# Altium project ISL6236A_DEMO_V1I1.PrjPcb
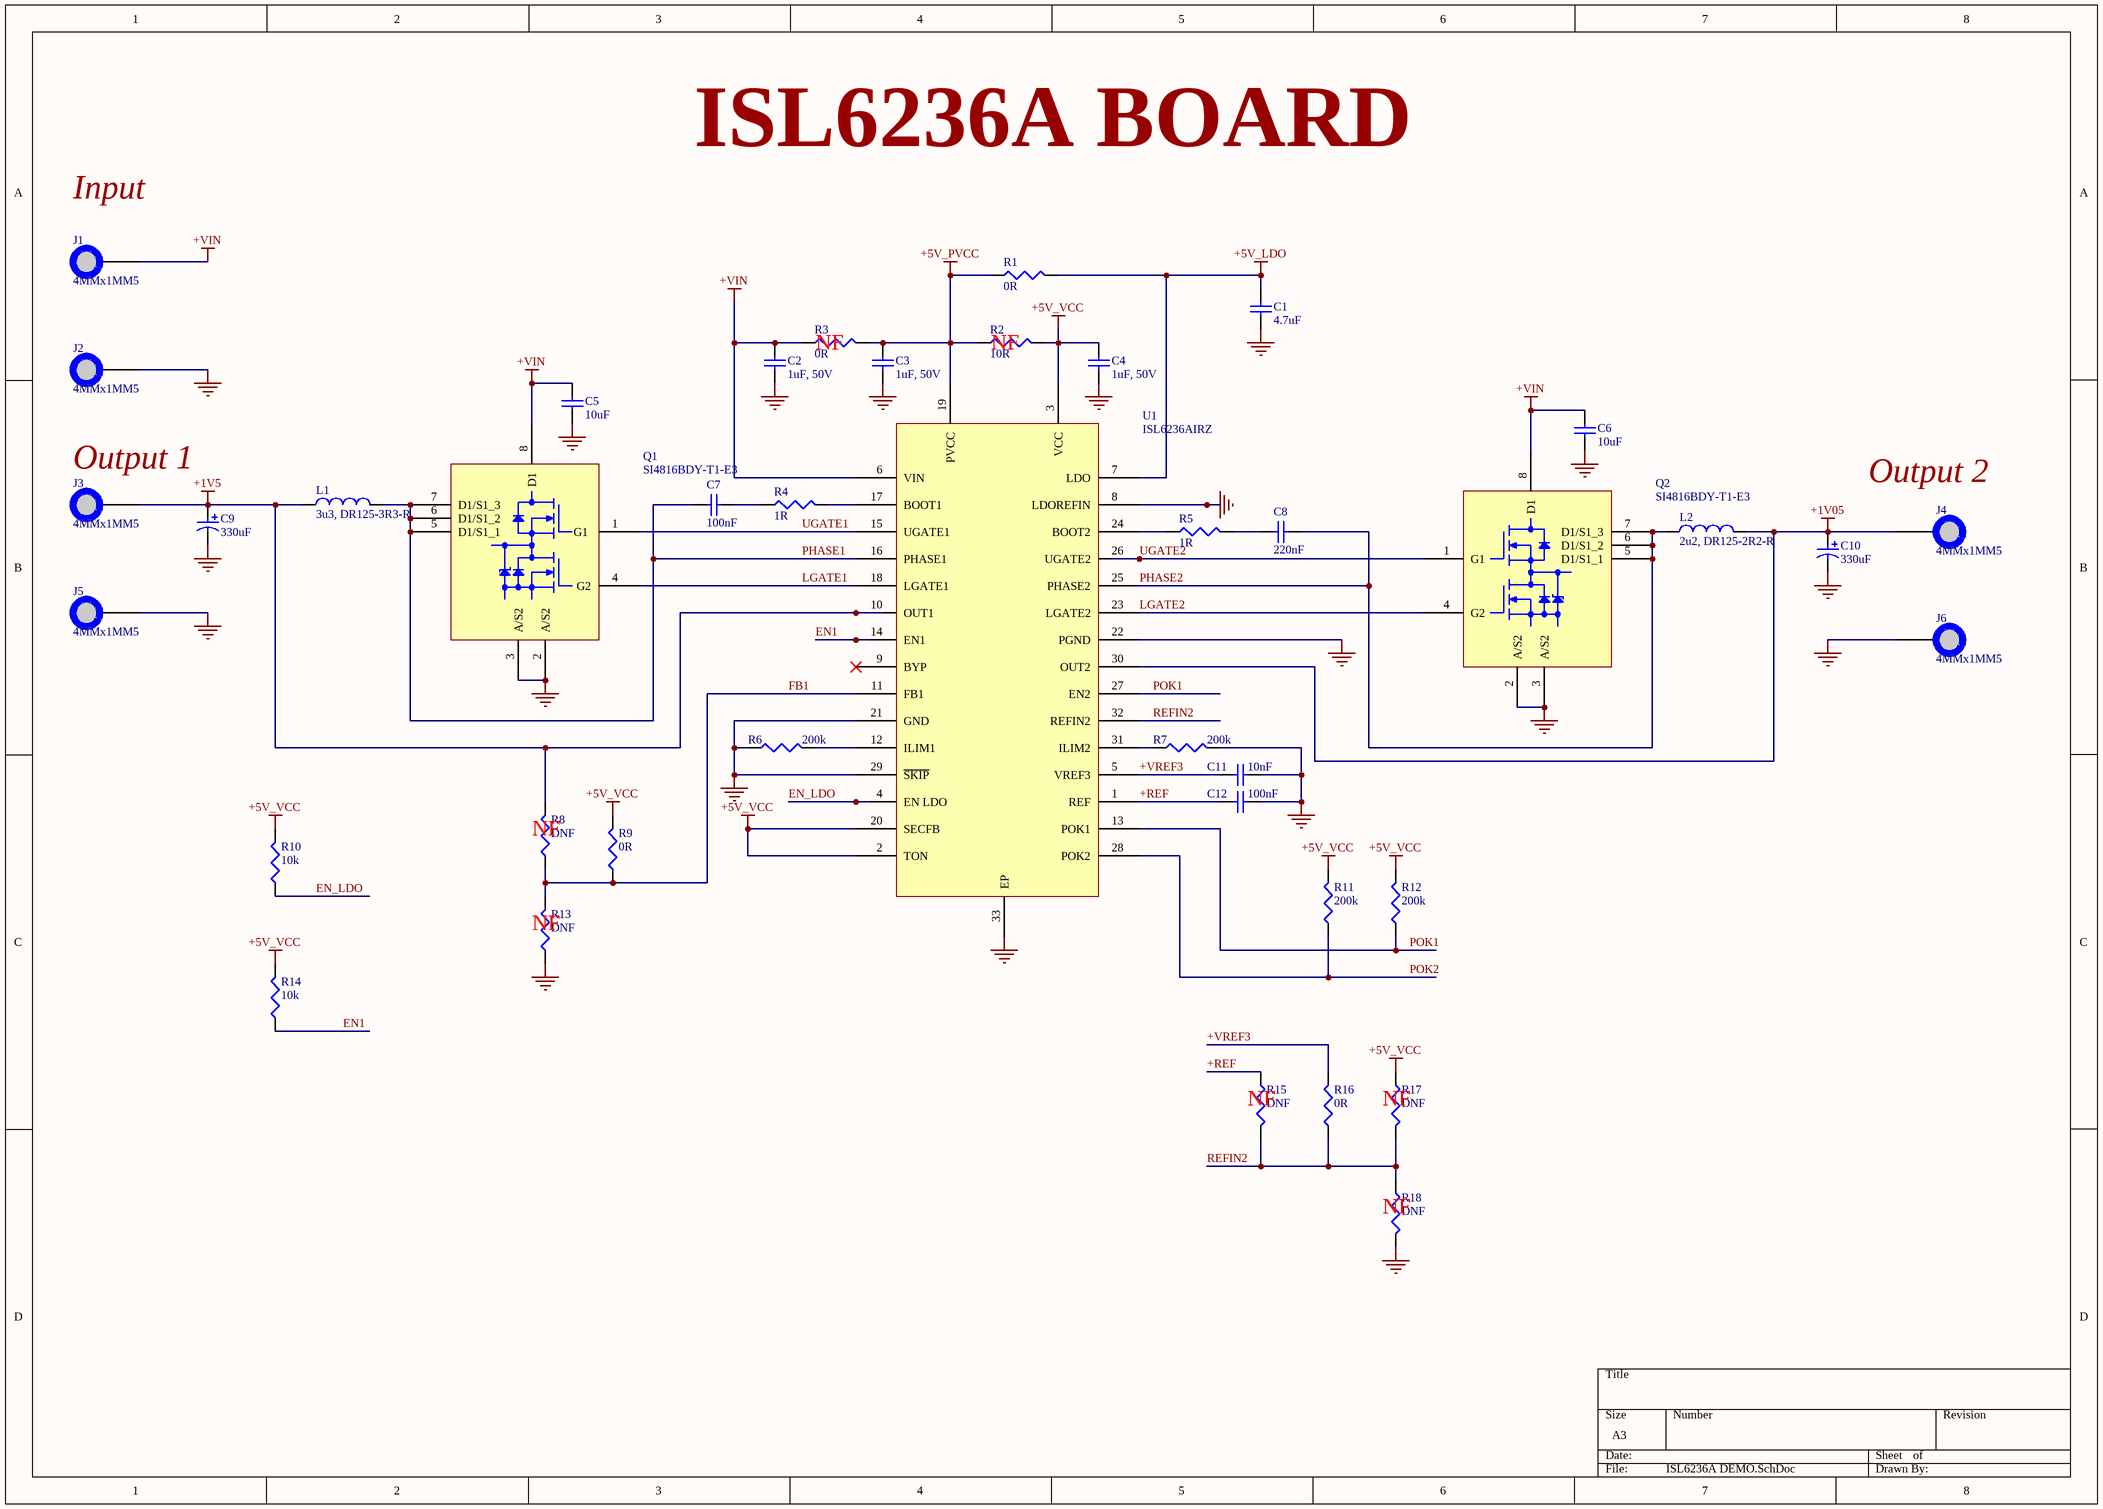
[diagram p0: ISL6236A DEMO.SchDoc]
1 sheet, 41 parts. Net scope: global (net labels, ports and power ports of the same name join across sheets).
Board file: ISL6236A DEMO_PCB_V1I1.PcbDoc

## Sheet ISL6236A DEMO.SchDoc
size A3

### Parts
C1  4.7uF  [C1206]
C2  1uF, 50V  [C0805]
C3  1uF, 50V  [C0805]
C4  1uF, 50V  [C0805]
C5  10uF  [C1210]
C6  10uF  [C1210]
C7  100nF  [C0805]
C8  220nF  [C0805]
C9  330uF  [7343-43]
C10  330uF  [7343-43]
C11  10nF  [C0805]
C12  100nF  [C0805]
J1  4MMx1MM5  [PAD_WITH_HOLE_4MMx1MM5]
J2  4MMx1MM5  [PAD_WITH_HOLE_4MMx1MM5]
J3  4MMx1MM5  [PAD_WITH_HOLE_4MMx1MM5]
J4  4MMx1MM5  [PAD_WITH_HOLE_4MMx1MM5]
J5  4MMx1MM5  [PAD_WITH_HOLE_4MMx1MM5]
J6  4MMx1MM5  [PAD_WITH_HOLE_4MMx1MM5]
L1  3u3, DR125-3R3-R  [DR125]
L2  2u2, DR125-2R2-R  [DR125]
Q1  SI4816BDY-T1-E3  [SO-8]
Q2  SI4816BDY-T1-E3  [SO-8]
R1  0R  [R0805]
R2  10R  [R0805]
R3  0R  [R0805]
R4  1R  [R0805]
R5  1R  [R0805]
R6  200k  [R0805]
R7  200k  [R0805]
R8  DNF  [R0805]
R9  0R  [R0805]
R10  10k  [R0805]
R11  200k  [R0805]
R12  200k  [R0805]
R13  DNF  [R0805]
R14  10k  [R0805]
R15  DNF  [R0805]
R16  0R  [R0805]
R17  DNF  [R0805]
R18  DNF  [R0805]
U1  ISL6236AIRZ  [L32.5x5B]

### Nets
+1V05: C10.1 J4.1 L2.2 U1.30(OUT2)
+1V5: C9.1 J3.1 L1.1 R8.2 U1.10(OUT1)
+5V_LDO: C1.1 R1.2 U1.7(LDO)
+5V_PVCC: C3.2 R1.1 R2.1 R3.2 U1.19(PVCC)
+5V_VCC: C4.2 R2.2 R9.2 R10.2 R11.2 R12.2 R14.2 R17.1 U1.2(TON) U1.3(VCC) U1.20(SECFB)
+VIN: C2.2 C5.2 C6.1 J1.1 Q1.8(D1) Q2.8(D1) R3.1 U1.6(VIN)
GND: C1.2 C2.1 C3.1 C4.1 C5.1 C6.2 C9.2 C10.2 C11.2 C12.2 J2.1 J5.1 J6.1 Q1.2(A/S2) Q1.3(A/S2) Q2.2(A/S2) Q2.3(A/S2) R6.1 R7.2 R13.1 R18.2 U1.8(LDOREFIN) U1.21(GND) U1.22(PGND) U1.29(~{SKIP}) U1.33(EP)
+REF: C12.1 R15.1 U1.1(REF)
+VREF3: C11.1 R16.2 U1.5(VREF3)
EN1: R14.1 U1.14(EN1)
EN_LDO: R10.1 U1.4(EN_LDO)
FB1: R8.1 R9.1 R13.2 U1.11(FB1)
LGATE1: Q1.4(G2) U1.18(LGATE1)
LGATE2: Q2.4(G2) U1.23(LGATE2)
PHASE1: C7.1 L1.2 Q1.5(D1/S1_1) Q1.6(D1/S1_2) Q1.7(D1/S1_3) U1.16(PHASE1)
PHASE2: C8.2 L2.1 Q2.5(D1/S1_1) Q2.6(D1/S1_2) Q2.7(D1/S1_3) U1.25(PHASE2)
POK1: R12.1 U1.13(POK1) U1.27(EN2)
POK2: R11.1 U1.28(POK2)
REFIN2: R15.2 R16.1 R17.2 R18.1 U1.32(REFIN2)
UGATE1: Q1.1(G1) U1.15(UGATE1)
UGATE2: Q2.1(G1) U1.26(UGATE2)
NetC7_2: C7.2 R4.1
NetC8_1: C8.1 R5.2
NetR4_2: R4.2 U1.17(BOOT1)
NetR5_1: R5.1 U1.24(BOOT2)
NetR6_2: R6.2 U1.12(ILIM1)
NetR7_1: R7.1 U1.31(ILIM2)

Not connected (* = marked no-connect by the designer): U1 9(BYP)*

### Notes on the sheet
- ISL6236A BOARD
- Input
- (near R3) NF
- (near R2) NF
- Output 1
- (near J4) Output 2
- (near R8) NF
- (near R13) NF
- (near R15) NF
- (near R17) NF
- (near R18) NF

### Library data of the parts
C1 = C3216X5R1H475K160AB: CAP CER 4.7UF 50V X5R 1206; Manufacturer 1: TDK; Dielectric Material: Ceramic; Tolerance: 10%; Supplier 1: Digi-Key; Manufacturer Part Number 1: C3216X5R1H475K160AB; Stock 1: 12830; Pricing 1: 1=0.90000, 10=0.66400, 100=0.45540, 500=0.36052, 1000=0.30360 (USD); RoHS: Yes; Mount: Surface Mount; Case/Package: 1206; Weight: 0.000571oz; Case Code (Imperial): 1206; Case Code (Metric): 3216; Min Operating Temperature: -55°C; Max Operating Temperature: 85°C; Capacitance: 4.7uF; Packaging: Tape and Reel; Voltage Rating: 50V; Voltage Rating (DC): 50V; Package Quantity: 1; Dielectric: X5R; Termination: SMD/SMT; Composition: Ceramic; Length: 3.2mm; Height: 1.6mm; Width: 1.6mm; Thickness: 0.071inch; Depth: 1.6mm; Lead Free: Lead Free; ComponentLink1URL: https://datasheet.ciiva.com/24216/c3216x5r1h475k160ab-265269-24216325.pdf?src-supplier=Mouser; ComponentLink1Description: https://datasheet.ciiva.com/24216/c3216x5r1h475k160ab-265269-24216325.pdf?src-supplier=Mouser; ComponentLink2URL: https://datasheet.ciiva.com/6286/tdkmlcccaprange-6286230.pdf?src-supplier=Digi-Key; ComponentLink2Description: https://datasheet.ciiva.com/6286/tdkmlcccaprange-6286230.pdf?src-supplier=Digi-Key; ComponentLink3URL: https://datasheet.ciiva.com/6286/tdkmlcccaprange-6286233.pdf?src-supplier=Digi-Key; ComponentLink3Description: https://datasheet.ciiva.com/6286/tdkmlcccaprange-6286233.pdf?src-supplier=Digi-Key; ComponentLink4URL: https://datasheet.ciiva.com/6286/tdkmlcccaprange-6286236.pdf?src-supplier=Digi-Key; ComponentLink4Description: https://datasheet.ciiva.com/6286/tdkmlcccaprange-6286236.pdf?src-supplier=Digi-Key; Supplier Part Number 1: 445-5994-1-ND
C2-C4 = C0805C105K5RACTU: Cap Ceramic 1uF 50V X7R 10% Pad SMD 0805 125°C T/R; Manufacturer 1: KEMET; Supplier 1: Digi-Key; Manufacturer Part Number 1: C0805C105K5RACTU; Stock 1: 0; Pricing 1: 1=0.40000, 10=0.27700, 100=0.16620, 500=0.12466, 1000=0.10527 (USD); RoHS: Yes; Mount: Surface Mount,PCB; Case/Package: 0805; Case Code (Metric): 2012; Case Code (Imperial): 0805; Contact Plating: Tin,Matte; Dielectric Material: Ceramic; Min Operating Temperature: -55°C; Max Operating Temperature: 125°C; Packaging: Tape and Reel; Capacitance: 1uF; Tolerance: 10%; Voltage Rating: 50V; Voltage Rating (DC): 50V; Package Quantity: 1; Dielectric: X7R; Termination: SMD/SMT; Voltage: 50V; Length: 2mm; Height: 1.25mm; Width: 0.049inch; Thickness: 0.055inch; Depth: 1.25mm; REACH SVHC: No SVHC; ComponentLink1URL: https://datasheet.ciiva.com/7842/1732744-7842192.pdf?src-supplier=Element14; ComponentLink1Description: https://datasheet.ciiva.com/7842/1732744-7842192.pdf?src-supplier=Element14; ComponentLink2URL: https://datasheet.ciiva.com/5408/kem-c1002-x7r-smd-5408569.pdf?src-supplier=Mouser; ComponentLink2Description: https://datasheet.ciiva.com/5408/kem-c1002-x7r-smd-5408569.pdf?src-supplier=Mouser; ComponentLink3URL: https://datasheet.ciiva.com/22700/1851736-22700523.pdf?src-supplier=Element14; ComponentLink3Description: https://datasheet.ciiva.com/22700/1851736-22700523.pdf?src-supplier=Element14; Supplier Part Number 1: 399-7409-1-ND
C5 C6 = C1210C106K6PACTU: KEMET - C1210C106K6PACTU - CAP, MLCC, X5R, 10UF, 35V, 1210; Dielectric Material: Ceramic; Dissipation Factor: 2.5%; Tolerance: 10%; Supplier 1: Digi-Key; Manufacturer 1: KEMET; Manufacturer Part Number 1: C1210C106K6PACTU; Stock 1: 52713; Pricing 1: 1=0.82000, 10=0.60300, 100=0.41380, 500=0.32760, 1000=0.27588 (USD); RoHS: Yes; Mount: Surface Mount; Case/Package: 1210; Case Code (Metric): 3225; Case Code (Imperial): 1210; Min Operating Temperature: -55°C; Max Operating Temperature: 85°C; Packaging: Tape and Reel; Capacitance: 10uF; Voltage Rating: 35V; Voltage: 35V; Dielectric: X5R; Termination: Solder; Voltage Rating (DC): 35V; Length: 0.126inch; Height: 1.9mm; Width: 0.098inch; Thickness: 0.083inch; Depth: 2.5mm; Lead Free: Lead Free; ComponentLink1URL: http://www.alliedelec.com/m/d/f3c02ddb98afa3dd1adcb801109671e9.pdf?src-supplier=Allied+Electronics; ComponentLink1Description: http://www.alliedelec.com/m/d/f3c02ddb98afa3dd1adcb801109671e9.pdf?src-supplier=Allied+Electronics; ComponentLink2URL: http://www.farnell.com/datasheets/2741192.pdf?src-supplier=Farnell; ComponentLink2Description: http://www.farnell.com/datasheets/2741192.pdf?src-supplier=Farnell; ComponentLink3URL: https://api.kemet.com/component-edge/download/datasheet/C1210C106K6PAC7800.pdf?src-supplier=Digi-Key; ComponentLink3Description: https://api.kemet.com/component-edge/download/datasheet/C1210C106K6PAC7800.pdf?src-supplier=Digi-Key; ComponentLink4URL: http://www.kemet.com/docfinder?Partnumber=C1210C106K6PAC7800&src-supplier=Digi-Key; ComponentLink4Description: http://www.kemet.com/docfinder?Partnumber=C1210C106K6PAC7800&src-supplier=Digi-Key; ComponentLink5URL: http://www.farnell.com/datasheets/2741192.pdf?src-supplier=Newark; ComponentLink5Description: http://www.farnell.com/datasheets/2741192.pdf?src-supplier=Newark; Supplier Part Number 1: 399-12070-1-ND
C7 C12 = C0805C104K5RACTU: Cap Ceramic 0.1uF 50V X7R 10% SMD 2.0 x 1.2 mm 125 C Paper T/R; Manufacturer 1: KEMET; Voltage: 500V; Supplier 1: Digi-Key; Manufacturer Part Number 1: C0805C104K5RACTU; Stock 1: 146225; Pricing 1: 1=0.17000, 10=0.12100, 100=0.05670, 500=0.03976, 1000=0.03291 (USD); RoHS: Yes; Mount: Surface Mount,PCB; Case/Package: 0805; Number of Pins: 2; Dielectric Material: Ceramic; Case Code (Imperial): 0805; Case Code (Metric): 2012; Contact Plating: Tin,Matte; Min Operating Temperature: -55°C; Max Operating Temperature: 125°C; Capacitance: 100nF; Tolerance: 10%; Packaging: Tape and Reel; Voltage Rating (DC): 50V; Dielectric: X7R; Termination: SMD/SMT; Package Quantity: 4000; Voltage Rating: 50V; Length: 2mm; Height: 0.9mm; Width: 1.2mm; Lead Pitch: 0.75mm; Depth: 1.25mm; Thickness: 0.035inch; Radiation Hardening: No; REACH SVHC: No SVHC; ComponentLink1URL: https://datasheet.ciiva.com/14589/70095383-14589048.pdf?src-supplier=Allied+Electronics; ComponentLink1Description: https://datasheet.ciiva.com/14589/70095383-14589048.pdf?src-supplier=Allied+Electronics; ComponentLink2URL: https://datasheet.ciiva.com/28682/1851736-28682232.pdf?src-supplier=Element14; ComponentLink2Description: https://datasheet.ciiva.com/28682/1851736-28682232.pdf?src-supplier=Element14; ComponentLink3URL: https://datasheet.ciiva.com/32431/slceramic-chip-condensers-e-32431755.pdf?src-supplier=Distrelec; ComponentLink3Description: https://datasheet.ciiva.com/32431/slceramic-chip-condensers-e-32431755.pdf?src-supplier=Distrelec; ComponentLink4URL: https://datasheet.ciiva.com/18410/70095383-18410815.pdf?src-supplier=Allied+Electronics; ComponentLink4Description: https://datasheet.ciiva.com/18410/70095383-18410815.pdf?src-supplier=Allied+Electronics; Supplier Part Number 1: 399-1170-6-ND
C8 = C0805C224K5RACTU: CAP CER 0.22UF 50V X7R 0805; Manufacturer 1: KEMET; Dielectric Material: Ceramic; Tolerance: 10%; Dissipation Factor: 2.5%; Supplier 1: Digi-Key; Manufacturer Part Number 1: C0805C224K5RACTU; Stock 1: 1706361; Pricing 1: 1=0.20000, 10=0.13900, 100=0.06550, 500=0.04592, 1000=0.03802 (USD); RoHS: Yes; Mount: Surface Mount,PCB; Case/Package: 0805; Case Code (Metric): 2012; Case Code (Imperial): 0805; Min Operating Temperature: -55°C; Max Operating Temperature: 125°C; Package Quantity: 1; Capacitance: 220nF; Voltage Rating: 50V; Packaging: Tape and Reel; Voltage Rating (DC): 50V; Dielectric: X7R; Termination: SMD/SMT; Voltage: 50V; Length: 2mm; Height: 1.1mm; Width: 0.049inch; Thickness: 0.055inch; Lead Pitch: 0.75mm; Depth: 1.25mm; Radiation Hardening: No; REACH SVHC: No SVHC; ComponentLink1URL: https://datasheet.ciiva.com/7842/kem-c1002-x7r-smd-7842582.pdf?src-supplier=Element14; ComponentLink1Description: https://datasheet.ciiva.com/7842/kem-c1002-x7r-smd-7842582.pdf?src-supplier=Element14; ComponentLink2URL: https://datasheet.ciiva.com/18193/getdatasheetpartid-304413-18193686.pdf?src-supplier=Verical; ComponentLink2Description: https://datasheet.ciiva.com/18193/getdatasheetpartid-304413-18193686.pdf?src-supplier=Verical; ComponentLink3URL: https://datasheet.ciiva.com/28682/1851736-28682316.pdf?src-supplier=Element14; ComponentLink3Description: https://datasheet.ciiva.com/28682/1851736-28682316.pdf?src-supplier=Element14; Supplier Part Number 1: 399-3491-1-ND
C9 C10 = T530X337M010ATE004: Tantalum Capacitors - Polymer SMD 330uF 10volts 20%; Manufacturer 1: KEMET; Ripple Current: 8.2A; Voltage Rating (DC): 10V; ESR (Equivalent Series Resistance): 4mR; Leakage Current: 330uA; Polarity: Polar; Dissipation Factor: 8%; Life (Hours): 2000Hour; Manufacturer Part Number 1: T530X337M010ATE004; Stock 1: 3288; Pricing 1: 1=6.86000, 10=6.09500, 100=4.87600 (USD); RoHS: Yes; Mount: Surface Mount,PCB; Case/Package: 2917; Case Code (Imperial): 2917; Case Code (Metric): 7343; Min Operating Temperature: -55°C; Max Operating Temperature: 125°C; Package Quantity: 500; Capacitance: 330uF; Tolerance: 20%; Packaging: Tape and Reel; Voltage Rating: 10V; Termination: SMD/SMT; Voltage: 10V; Features: General Purpose; Length: 7.3mm; Height: 4mm; Width: 4.3mm; Height - Seated (Max): 0.169inch; Depth: 4.3mm; REACH SVHC: No SVHC; ComponentLink1URL: https://datasheet.ciiva.com/11794/0900766b80deaa91-11794477.pdf?src-supplier=RSComponents; ComponentLink1Description: https://datasheet.ciiva.com/11794/0900766b80deaa91-11794477.pdf?src-supplier=RSComponents; ComponentLink2URL: https://datasheet.ciiva.com/14593/70096008-14593753.pdf?src-supplier=Allied+Electronics; ComponentLink2Description: https://datasheet.ciiva.com/14593/70096008-14593753.pdf?src-supplier=Allied+Electronics; Supplier 1: Digi-Key; Supplier Part Number 1: 399-10378-1-ND
C11 = C0805F103K5RACTU: CAP CER 10000PF 50V X7R 0805; Manufacturer 1: KEMET; Dielectric Material: Ceramic; Tolerance: 10%; Supplier 1: Digi-Key; Manufacturer Part Number 1: C0805F103K5RACTU; Stock 1: 104000; Pricing 1: 1=0.34000, 10=0.23600, 100=0.14170, 500=0.10624, 1000=0.08972 (USD); RoHS: Yes; Mount: Surface Mount; Case/Package: 0805; Number of Pins: 2; Case Code (Imperial): 0805; Case Code (Metric): 2012; Min Operating Temperature: -55°C; Max Operating Temperature: 125°C; Capacitance: 10nF; Package Quantity: 4000; Voltage Rating: 50V; Voltage Rating (DC): 50V; Packaging: Tape and Reel; Dielectric: X7R; Termination: SMD/SMT; Voltage: 50V; Length: 2mm; Height: 0.9mm; Width: 1.25mm; Lead Pitch: 0.75mm; Thickness: 0.039inch; Depth: 1.25mm; Radiation Hardening: No; REACH SVHC: No SVHC; ComponentLink1URL: https://datasheet.ciiva.com/146/docfinderpartnumber-c0805f103k5ractu-146278.pdf?src-supplier=Digi-Key; ComponentLink1Description: https://datasheet.ciiva.com/146/docfinderpartnumber-c0805f103k5ractu-146278.pdf?src-supplier=Digi-Key; ComponentLink2URL: https://datasheet.ciiva.com/7842/48829-7842407.pdf?src-supplier=Element14; ComponentLink2Description: https://datasheet.ciiva.com/7842/48829-7842407.pdf?src-supplier=Element14; ComponentLink3URL: https://datasheet.ciiva.com/7842/48829-7842408.pdf?src-supplier=Element14; ComponentLink3Description: https://datasheet.ciiva.com/7842/48829-7842408.pdf?src-supplier=Element14; Supplier Part Number 1: 399-5107-1-ND
J1-J6 = PAD_WITH_HOLE_4MMx1MM5
L1 = DR125-3R3-R: FIXED IND 3.3UH 9.26A 6.3 MOHM; Manufacturer 1: Eaton Cooper; Core Material: Ferrite; Saturation Current: 12.7A; Tolerance: 20%; Shielding: Shielded; DC Resistance (DCR): 6.3mR; Test Frequency: 100kHz; Supplier 1: Digi-Key; Manufacturer Part Number 1: DR125-3R3-R; Stock 1: 1790; Pricing 1: 1=2.03000, 10=1.87300, 100=1.31130 (USD); RoHS: Yes; Mount: Surface Mount; Case/Package: Nonstandard; Number of Pins: 2; Min Operating Temperature: -40°C; Max Operating Temperature: 125°C; Packaging: Tape and Reel; Inductance Tolerance: 20%; Package Quantity: 600; Inductance: 3.3uH; Max DC Current: 9.26A; Termination: SMD/SMT; RMS Current (Irms): 9.26A; Self Resonant Frequency: 100kHz; Military Standard: Not; Current Rating: 9.26A; Composition: Wirewound; Length: 12.5mm; Height: 6mm; Width: 0.492inch; Depth: 12.5mm; Height - Seated (Max): 0.236inch; Radiation Hardening: No; REACH SVHC: No SVHC; ComponentLink1URL: https://datasheet.ciiva.com/26858/getdatasheetpartid-251124-26858392.pdf?src-supplier=Verical; ComponentLink1Description: https://datasheet.ciiva.com/26858/getdatasheetpartid-251124-26858392.pdf?src-supplier=Verical; ComponentLink2URL: https://datasheet.ciiva.com/5707/87246-5707962.pdf?src-supplier=Farnell; ComponentLink2Description: https://datasheet.ciiva.com/5707/87246-5707962.pdf?src-supplier=Farnell; ComponentLink3URL: https://datasheet.ciiva.com/16295/bus-elx-ds-4315-dr-series-16295562.pdf?src-supplier=Future+Electronics; ComponentLink3Description: https://datasheet.ciiva.com/16295/bus-elx-ds-4315-dr-series-16295562.pdf?src-supplier=Future+Electronics; ComponentLink4URL: https://datasheet.ciiva.com/30081/4a32919a-7470-4ae0-be45-b59e3a1351ef-30081146.pdf?src-supplier=Onlinecomponents.com; ComponentLink4Description: https://datasheet.ciiva.com/30081/4a32919a-7470-4ae0-be45-b59e3a1351ef-30081146.pdf?src-supplier=Onlinecomponents.com; Supplier Part Number 1: 513-1529-1-ND
L2 = DR125-2R2-R: FIXED IND 2.2UH 10.9A 4.5 MOHM; Manufacturer 1: Eaton Cooper; Core Material: Ferrite; Tolerance: 20%; Saturation Current: 15A; Shielding: Shielded; DC Resistance (DCR): 4.5mR; Test Frequency: 100kHz; Supplier 1: Digi-Key; Manufacturer Part Number 1: DR125-2R2-R; Stock 1: 820; Pricing 1: 1=2.03000, 10=1.87300, 100=1.31130 (USD); RoHS: Yes; Mount: Surface Mount; Case/Package: Nonstandard; Number of Pins: 2; Weight: 0.144oz; Min Operating Temperature: -40°C; Max Operating Temperature: 125°C; Inductance: 2.2uH; Max DC Current: 10.9A; Package Quantity: 600; Current Rating: 10.9A; Packaging: Tape and Reel; Inductance Tolerance: 20%; Composition: Wirewound; Termination: SMD/SMT; Self Resonant Frequency: 100kHz; DC Current: 10.9A; Military Standard: Not; RMS Current (Irms): 10.9A; Length: 12.5mm; Height: 6mm; Width: 0.492inch; Height - Seated (Max): 0.236inch; Depth: 12.5mm; Radiation Hardening: No; REACH SVHC: No SVHC; Lead Free: Lead Free; ComponentLink1URL: https://datasheet.ciiva.com/14667/0900766b8116a153-14667792.pdf?src-supplier=RSComponents; ComponentLink1Description: https://datasheet.ciiva.com/14667/0900766b8116a153-14667792.pdf?src-supplier=RSComponents; ComponentLink2URL: https://datasheet.ciiva.com/26926/getdatasheetpartid-571249-26926912.pdf?src-supplier=Verical; ComponentLink2Description: https://datasheet.ciiva.com/26926/getdatasheetpartid-571249-26926912.pdf?src-supplier=Verical; ComponentLink3URL: https://datasheet.ciiva.com/8004/87246-8004874.pdf?src-supplier=Element14; ComponentLink3Description: https://datasheet.ciiva.com/8004/87246-8004874.pdf?src-supplier=Element14; Supplier Part Number 1: 513-1662-1-ND
Q1 Q2 = SI4816BDY-T1-E3: MOSFET 2N-CH 30V 5.8A 8-SOIC; Manufacturer 1: Vishay Siliconix; Nominal Vgs: 3V; Rise Time: 9ns; Rds On Max: 18.5mR; Number of Elements: 2; Continuous Drain Current (ID): 8.2A; Drain to Source Resistance: 11.5mR; Gate to Source Voltage (Vgs): 20V; Max Power Dissipation: 1.25W; Turn-Off Delay Time: 31ns; Turn-On Delay Time: 13ns; Threshold Voltage: 1V; Element Configuration: Single; FET Type: 2 N-Channel; Supplier 1: Digi-Key; Manufacturer Part Number 1: SI4816BDY-T1-E3; Stock 1: 3182; Pricing 1: 1=1.61000, 10=1.44700, 100=1.06450, 500=0.90074, 1000=0.76426 (USD); RoHS: Yes; Mount: Surface Mount; Case/Package: SO; Number of Pins: 8; Weight: 0.006596oz; Min Operating Temperature: -55°C; Max Operating Temperature: 150°C; Packaging: Tape and Reel; Package Quantity: 1; Drain to Source Voltage (Vdss): 30V; Fall Time: 9ns; Number of Channels: 2; On-State Resistance: 18.5mR; Length: 5mm; Height: 1.55mm; Width: 4mm; Radiation Hardening: No; REACH SVHC: Unknown; Lead Free: Lead Free; ComponentLink1URL: https://datasheet.ciiva.com/7710/si4816bd-7710449.pdf?src-supplier=Element14; ComponentLink1Description: https://datasheet.ciiva.com/7710/si4816bd-7710449.pdf?src-supplier=Element14; ComponentLink2URL: https://datasheet.ciiva.com/15137/getdatasheetpartid-99188-15137841.pdf?src-supplier=Verical; ComponentLink2Description: https://datasheet.ciiva.com/15137/getdatasheetpartid-99188-15137841.pdf?src-supplier=Verical; ComponentLink3URL: https://datasheet.ciiva.com/26789/si4816bdy-t1-e3-26789112.pdf?src-supplier=IIIC; ComponentLink3Description: https://datasheet.ciiva.com/26789/si4816bdy-t1-e3-26789112.pdf?src-supplier=IIIC; ComponentLink4URL: https://datasheet.ciiva.com/18448/70026226-18448822.pdf?src-supplier=Allied+Electronics; ComponentLink4Description: https://datasheet.ciiva.com/18448/70026226-18448822.pdf?src-supplier=Allied+Electronics; ComponentLink5URL: https://datasheet.ciiva.com/16486/si4816bd-16486349.pdf?src-supplier=Future+Electronics; ComponentLink5Description: https://datasheet.ciiva.com/16486/si4816bd-16486349.pdf?src-supplier=Future+Electronics; ComponentLink6URL: https://datasheet.ciiva.com/26136/si4816bd-26136990.pdf?src-supplier=Avnet+Europe; ComponentLink6Description: https://datasheet.ciiva.com/26136/si4816bd-26136990.pdf?src-supplier=Avnet+Europe; ComponentLink7URL: https://datasheet.ciiva.com/11161/si4816bd-11161496.pdf?src-supplier=Avnet; ComponentLink7Description: https://datasheet.ciiva.com/11161/si4816bd-11161496.pdf?src-supplier=Avnet; ComponentLink8URL: https://datasheet.ciiva.com/928/si4816bd-928458.pdf?src-supplier=Digi-Key; ComponentLink8Description: https://datasheet.ciiva.com/928/si4816bd-928458.pdf?src-supplier=Digi-Key; ComponentLink9URL: https://datasheet.ciiva.com/928/si4816bd-928459.pdf?src-supplier=Digi-Key; ComponentLink9Description: https://datasheet.ciiva.com/928/si4816bd-928459.pdf?src-supplier=Digi-Key; ComponentLink10URL: https://datasheet.ciiva.com/928/si4816bd-928460.pdf?src-supplier=Digi-Key; ComponentLink10Description: https://datasheet.ciiva.com/928/si4816bd-928460.pdf?src-supplier=Digi-Key; Supplier Part Number 1: SI4816BDY-T1-E3CT-ND
R1 R3 R9 R16 = AC0805JR-070RL: Thick Film Resistors - SMD 1/8W 0.0ohm 5%; Manufacturer 1: Yageo; Power Rating: 125mW; Voltage Rating: 150V; Resistance: 0mR; Temperature Coefficient: 200ppm/°C; Supplier 1: Digi-Key; Manufacturer Part Number 1: AC0805JR-070RL; Stock 1: 40206; Pricing 1: 1=0.10000, 10=0.04500, 25=0.03280, 50=0.02500, 100=0.01840, 250=0.01400, 500=0.01120, 1000=0.00825 (USD); RoHS: Yes; Case/Package: 0805; Case Code (Imperial): 0805; Case Code (Metric): 2012; Min Operating Temperature: -55°C; Max Operating Temperature: 155°C; Packaging: Tape and Reel; Tolerance: 5%; Composition: Thick Film; Termination: SMD/SMT; Number of Terminations: 2; Max Power Dissipation: 125mW; Features: Moisture Resistant,Automotive AEC-Q200; Length: 0.079inch; Height: 0.024inch; Width: 1.25mm; Lead Free: Lead Free; ComponentLink1URL: http://www.yageo.com/documents/recent/PYu-AC_51_RoHS_L_2.pdf?src-supplier=Mouser; ComponentLink1Description: http://www.yageo.com/documents/recent/PYu-AC_51_RoHS_L_2.pdf?src-supplier=Mouser; ComponentLink2URL: http://www.yageo.com/NewPortal/yageodocoutput?fileName=/pdf/R-Chip/PYu-AC_51_RoHS_L_6.pdf&src-supplier=Digi-Key; ComponentLink2Description: http://www.yageo.com/NewPortal/yageodocoutput?fileName=/pdf/R-Chip/PYu-AC_51_RoHS_L_6.pdf&src-supplier=Digi-Key; Supplier Part Number 1: YAG3755CT-ND
R2 = AC0805FR-0710RL: Thick Film Resistors - SMD 1/8W 10ohm 1% AEC-Q200; Manufacturer 1: Yageo; Power Rating: 125mW; Voltage Rating: 150V; Temperature Coefficient: 200ppm/°C; Supplier 1: Digi-Key; Manufacturer Part Number 1: AC0805FR-0710RL; Stock 1: 526844; Pricing 1: 1=0.10000, 10=0.08600, 100=0.03330, 1000=0.01463, 2500=0.01264 (USD); RoHS: Yes; Case/Package: 0805; Case Code (Imperial): 0805; Case Code (Metric): 2012; Min Operating Temperature: -55°C; Max Operating Temperature: 155°C; Packaging: Tape and Reel; Resistance: 10R; Tolerance: 1%; Composition: Thick Film; Termination: SMD/SMT; Number of Terminations: 2; Military Standard: Not; Max Power Dissipation: 125mW; Features: Moisture Resistant,Automotive AEC-Q200; Length: 2mm; Height: 0.024inch; Width: 1.25mm; Depth: 1.25mm; Lead Free: Lead Free; ComponentLink1URL: http://www.mouser.com/ds/2/447/yageodocoutput-1111992.pdf?src-supplier=Mouser; ComponentLink1Description: http://www.mouser.com/ds/2/447/yageodocoutput-1111992.pdf?src-supplier=Mouser; ComponentLink2URL: http://components.arrow.com/part/dataview/0323_03350463?src-supplier=Arrow+Europe; ComponentLink2Description: http://components.arrow.com/part/dataview/0323_03350463?src-supplier=Arrow+Europe; ComponentLink3URL: http://www.yageo.com/NewPortal/yageodocoutput?fileName=/pdf/R-Chip/PYu-AC_51_RoHS_L_6.pdf&src-supplier=Digi-Key; ComponentLink3Description: http://www.yageo.com/NewPortal/yageodocoutput?fileName=/pdf/R-Chip/PYu-AC_51_RoHS_L_6.pdf&src-supplier=Digi-Key; ComponentLink4URL: http://www.yageo.com/documents/recent/PYu-AC_51_RoHS_L_2_revised.pdf?src-supplier=Future+Electronics; ComponentLink4Description: http://www.yageo.com/documents/recent/PYu-AC_51_RoHS_L_2_revised.pdf?src-supplier=Future+Electronics; Supplier Part Number 1: YAG3690CT-ND
R4 R5 = AC0805FR-071RL: AC Series 0805 0.125 W 1 Ohm ±1% ±200 ppm/°C SMT Thick Film Chip Resistor; Manufacturer 1: Yageo; Voltage Rating: 150V; Power Rating: 125mW; Supplier 1: Digi-Key; Manufacturer Part Number 1: AC0805FR-071RL; Stock 1: 22203; Pricing 1: 1=0.10000, 10=0.08600, 100=0.03330, 1000=0.01463, 2500=0.01264 (USD); RoHS: Yes; Case/Package: 0805; Weight: 0.000194oz; Case Code (Imperial): 0805; Case Code (Metric): 2012; Min Operating Temperature: -55°C; Max Operating Temperature: 155°C; Packaging: Tape and Reel; Tolerance: 1%; Resistance: 1R; Composition: Thick Film; Number of Terminations: 2; Termination: SMD/SMT; Max Power Dissipation: 125mW; Temperature Coefficient: 200ppm/°C; Features: Moisture Resistant,Automotive AEC-Q200; Length: 0.079inch; Height: 0.024inch; Width: 0.049inch; Lead Free: Lead Free; ComponentLink1URL: https://datasheet.ciiva.com/12576/pyu-ac-51-rohs-l-2-12576553.pdf?src-supplier=Mouser; ComponentLink1Description: https://datasheet.ciiva.com/12576/pyu-ac-51-rohs-l-2-12576553.pdf?src-supplier=Mouser; Supplier Part Number 1: YAG3705CT-ND
R6 R7 R11 R12 = AC0805FR-07200KL: Thick Film Resistors - SMD 1/8W 200K ohm 1% AEC-Q200; Manufacturer 1: Yageo; Power Rating: 125mW; Resistance: 200kR; Voltage Rating: 150V; Temperature Coefficient: 100ppm/°C; Supplier 1: Digi-Key; Manufacturer Part Number 1: AC0805FR-07200KL; Stock 1: 918; Pricing 1: 1=0.10000, 10=0.04800, 100=0.01970, 1000=0.00885, 2500=0.00768 (USD); RoHS: Yes; Case/Package: 0805; Case Code (Imperial): 0805; Case Code (Metric): 2012; Min Operating Temperature: -55°C; Max Operating Temperature: 155°C; Tolerance: 1%; Packaging: Tape and Reel; Composition: Thick Film; Number of Terminations: 2; Termination: SMD/SMT; Max Power Dissipation: 125mW; Features: Moisture Resistant,Automotive AEC-Q200; Length: 0.079inch; Height: 0.024inch; Width: 0.049inch; Lead Free: Lead Free; ComponentLink1URL: http://www.mouser.com/ds/2/447/yageodocoutput-1111992.pdf?src-supplier=Mouser; ComponentLink1Description: http://www.mouser.com/ds/2/447/yageodocoutput-1111992.pdf?src-supplier=Mouser; ComponentLink2URL: http://www.yageo.com/NewPortal/yageodocoutput?fileName=/pdf/R-Chip/PYu-AC_51_RoHS_L_6.pdf&src-supplier=Digi-Key; ComponentLink2Description: http://www.yageo.com/NewPortal/yageodocoutput?fileName=/pdf/R-Chip/PYu-AC_51_RoHS_L_6.pdf&src-supplier=Digi-Key; ComponentLink3URL: http://www.yageo.com/documents/recent/PYu-AC_51_RoHS_L_2.pdf?src-supplier=Future+Electronics; ComponentLink3Description: http://www.yageo.com/documents/recent/PYu-AC_51_RoHS_L_2.pdf?src-supplier=Future+Electronics; Supplier Part Number 1: YAG3706CT-ND
R8 R13 R15 R17 R18 = RES
R10 R14 = AC0805FR-0710KL: RES SMD 10K OHM 1% 1/8W 0805; Manufacturer 1: Yageo; Resistance: 10kR; Power Rating: 125mW; Voltage Rating: 150V; Temperature Coefficient: 100ppm/°C; Supplier 1: Digi-Key; Manufacturer Part Number 1: AC0805FR-0710KL; Stock 1: 626880; Pricing 1: 1=0.10000, 10=0.04800, 100=0.01970, 1000=0.00885, 2500=0.00768 (USD); RoHS: Yes; Case/Package: 0805; Case Code (Metric): 2012; Case Code (Imperial): 0805; Min Operating Temperature: -55°C; Max Operating Temperature: 155°C; Packaging: Tape and Reel; Tolerance: 1%; Package Quantity: 1; Composition: Thick Film; Number of Terminations: 2; Termination: SMD/SMT; Military Standard: Not; Max Power Dissipation: 125mW; Features: Moisture Resistant,Automotive AEC-Q200,Anti-Sulfur; Length: 0.079inch; Height: 0.024inch; Width: 0.049inch; Depth: 1.25mm; Lead Free: Lead Free; ComponentLink1URL: https://datasheet.ciiva.com/5558/pyu-ac-51-rohs-l-2-5558347.pdf?src-supplier=Mouser; ComponentLink1Description: https://datasheet.ciiva.com/5558/pyu-ac-51-rohs-l-2-5558347.pdf?src-supplier=Mouser; Supplier Part Number 1: 311-10KLGCT-ND
U1 = ISL6236AIRZ: IC MAIN PWR CTRLR QUAD 32-QFN; Manufacturer 1: Intersil; Number of Outputs: 2; Output Current: 20A; Switching Frequency: 500kHz; Supplier 1: Digi-Key; Manufacturer Part Number 1: ISL6236AIRZ; Stock 1: 0; Pricing 1: 600=3.818000 (USD); RoHS: Yes; Mount: Surface Mount; Case/Package: QFN; Min Operating Temperature: -40°C; Max Operating Temperature: 100°C; Packaging: Rail/Tube; Package Quantity: 60; Length: 5mm; Height: 0.95mm; Width: 5mm; Radiation Hardening: No; Lead Free: Lead Free; ComponentLink1URL: https://datasheet.ciiva.com/25905/fn6453-25905351.pdf?src-supplier=Avnet+Europe; ComponentLink1Description: https://datasheet.ciiva.com/25905/fn6453-25905351.pdf?src-supplier=Avnet+Europe; Supplier Part Number 1: ISL6236AIRZ-ND